# Altium schematic sheet USB7050P.SchDoc
size A; SheetNumber: 1; SheetTotal: 2
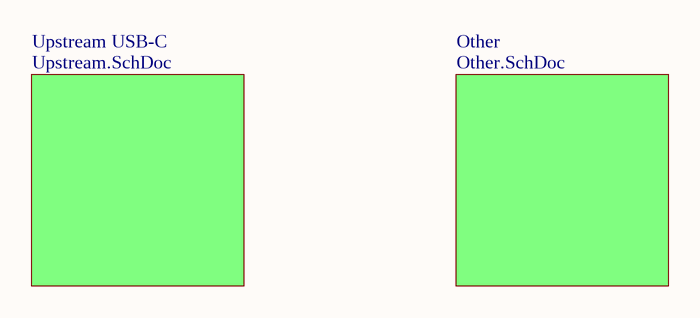
[diagram p0: USB7050P.SchDoc]

## Sub-sheets
Other = Other.SchDoc: no entries
Upstream USB-C = Upstream.SchDoc: no entries